# EAGLE schematic schematic (EAGLE 9.6.2)
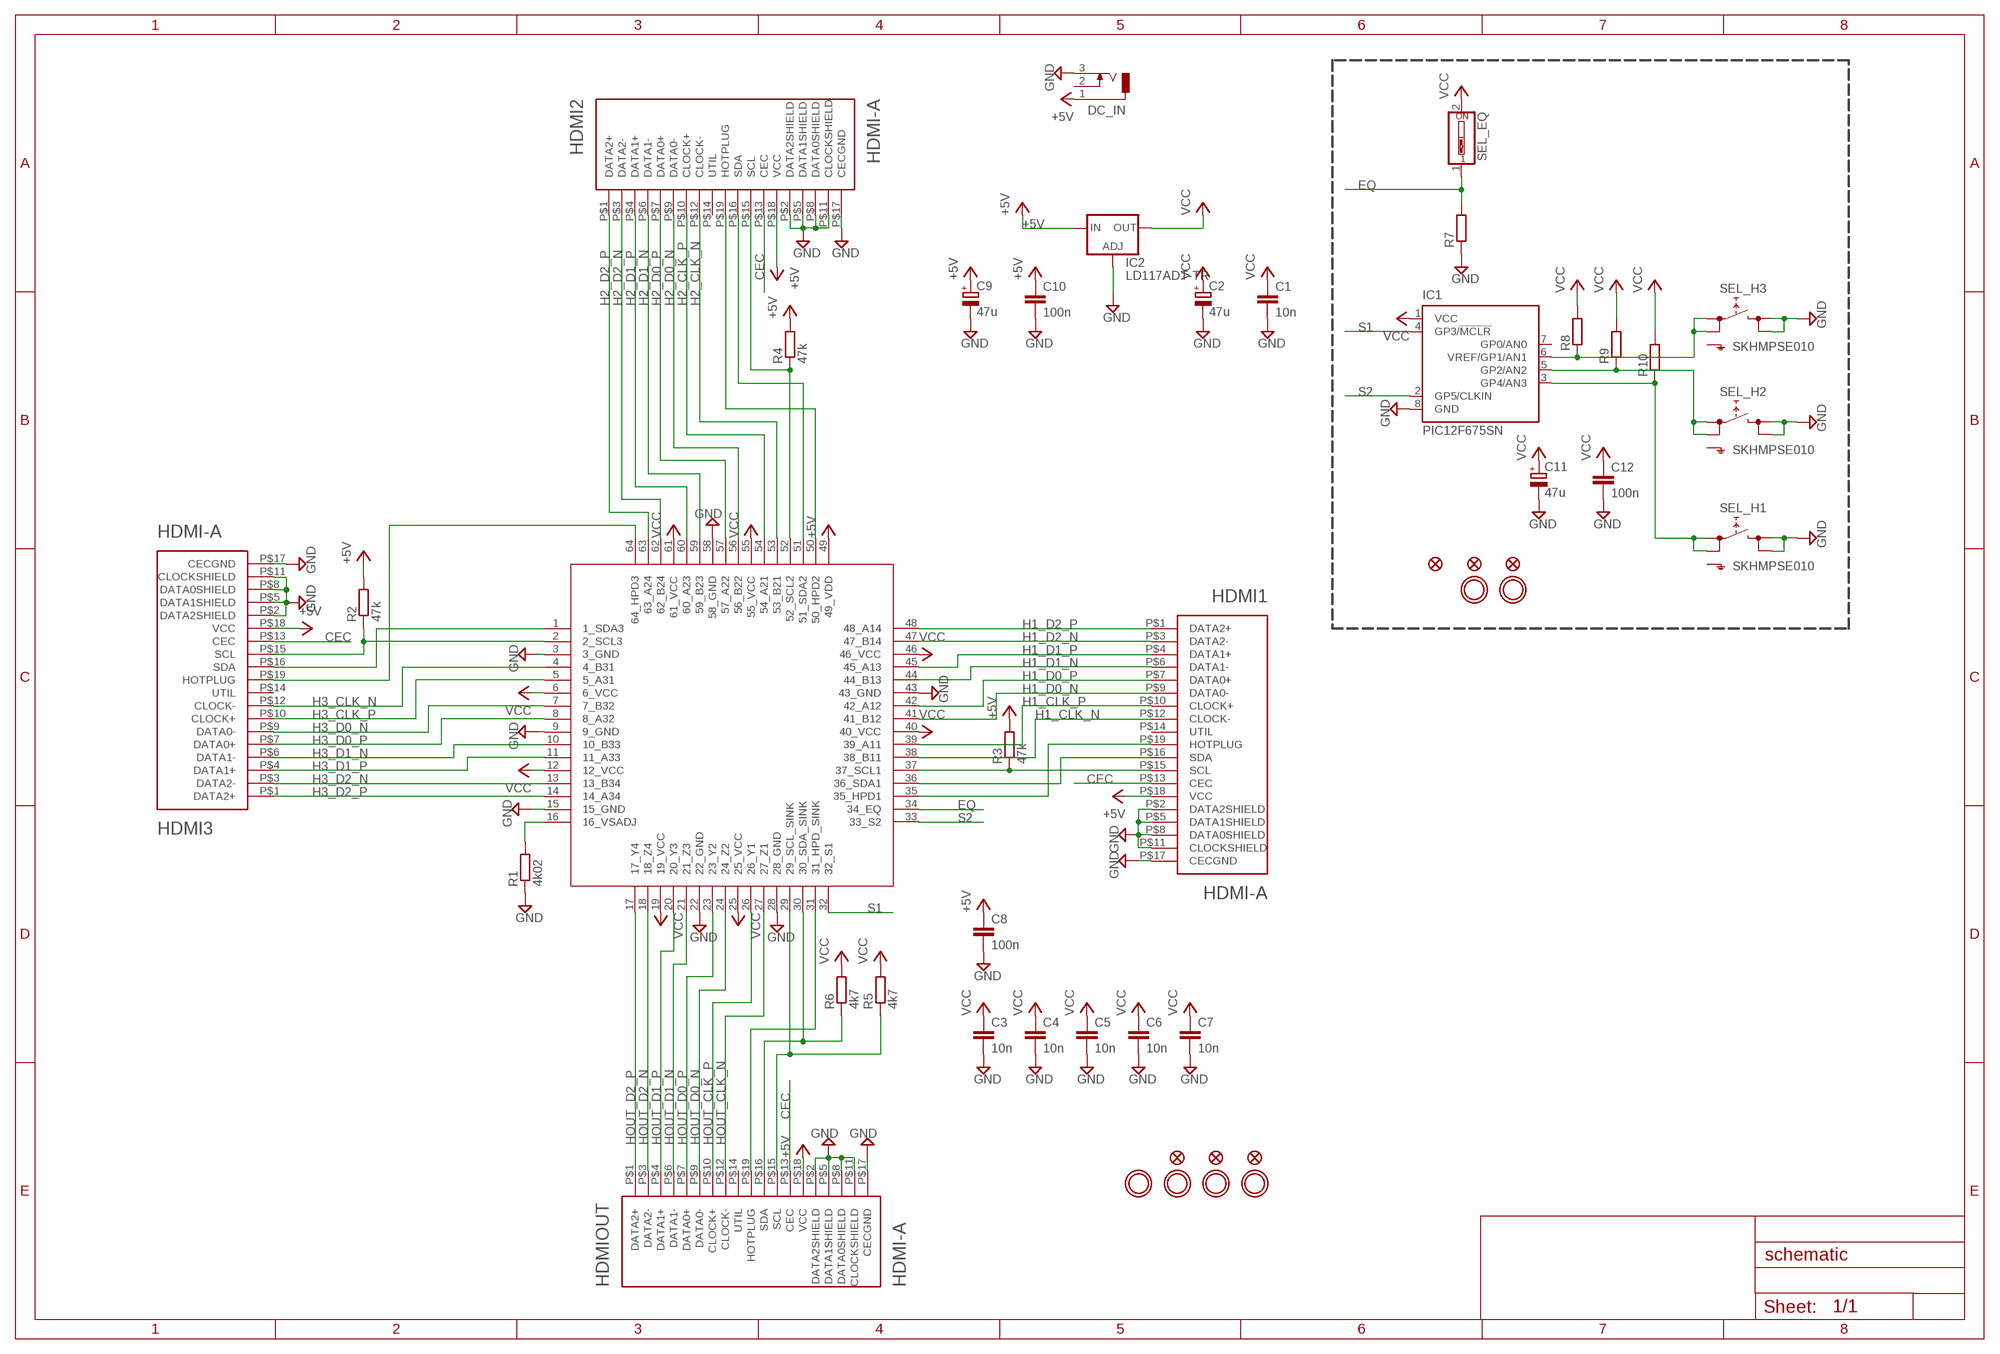
[diagram p0: schematic, sheet 1]

## Parts
C1  10n  C-EUC0402  [C0402]
C2  47u  CPOL-EUSMCA  [SMC_A]
C3  10n  C0402  [0402]
C4  10n  C0402  [0402]
C5  10n  C0402  [0402]
C6  10n  C0402  [0402]
C7  10n  C0402  [0402]
C8  100n  C0402  [0402]
C9  47u  CPOL-EUSMCA  [SMC_A]
C10  100n  C-EUC0402  [C0402]
C11  47u  CPOL-EUSMCA  [SMC_A]
C12  100n  C-EUC0402  [C0402]
DC_IN  DCJ0303  [DCJ0303]
FID1  FIDUCIAL""  [FIDUCIAL_1MM]
FID2  FIDUCIAL""  [FIDUCIAL_1MM]
FID3  FIDUCIAL""  [FIDUCIAL_1MM]
FID4  FIDUCIAL""  [FIDUCIAL_1MM]
FID5  FIDUCIAL""  [FIDUCIAL_1MM]
FID6  FIDUCIAL""  [FIDUCIAL_1MM]
HDMI1  HDMI-A  [HDMI_A]
HDMI2  HDMI-A  [HDMI_A]
HDMI3  HDMI-A  [HDMI_A]
HDMIOUT  HDMI-A  [HDMI_A]
IC1  PIC12F675SN  [SO-08]
IC2  LD117ADT-TR  [DPACK]
R1  4k02  R0402  [0402]
R2  47k  R0402  [0402]
R3  47k  R0402  [0402]
R4  47k  R0402  [0402]
R5  4k7  R0402  [0402]
R6  4k7  R0402  [0402]
R7  R-EU_R0805  [R0805]
R8  R-EU_R0805  [R0805]
R9  R-EU_R0805  [R0805]
R10  R-EU_R0805  [R0805]
SEL_EQ  SW_DIP-1  [EDG-01]
SEL_H1  SKHMPSE010  [SKHMPXE010]
SEL_H2  SKHMPSE010  [SKHMPXE010]
SEL_H3  SKHMPSE010  [SKHMPXE010]
U1  TMDS351TQFP64  [QFP50P1200X1200X120-64]
U$1  MOUNTINGHOLE3.0  [MOUNTINGHOLE_3.0_PLATED]
U$2  MOUNTINGHOLE3.0  [MOUNTINGHOLE_3.0_PLATED]
U$31  MOUNTINGHOLE3.0  [MOUNTINGHOLE_3.0_PLATED]
U$32  MOUNTINGHOLE3.0  [MOUNTINGHOLE_3.0_PLATED]
U$33  MOUNTINGHOLE3.0  [MOUNTINGHOLE_3.0_PLATED]
U$34  MOUNTINGHOLE3.0  [MOUNTINGHOLE_3.0_PLATED]

## Nets
+5V: C8.1 C9.+ C10.1 DC_IN.1 HDMI1.P$18(VCC) HDMI2.P$18(VCC) HDMI3.P$18(VCC) HDMIOUT.P$18(VCC) IC2.3(IN) R2.2 R3.2 R4.2 U1.49(49_VDD)
CEC: HDMI1.P$13(CEC) HDMI2.P$13(CEC) HDMI3.P$13(CEC) HDMIOUT.P$13(CEC)
EQ: R7.2 SEL_EQ.1 U1.34(34_EQ)
GND: C1.2 C2.- C3.2 C4.2 C5.2 C6.2 C7.2 C8.2 C9.- C10.2 C11.- C12.2 DC_IN.3 HDMI1.P$2(DATA2SHIELD) HDMI1.P$5(DATA1SHIELD) HDMI1.P$8(DATA0SHIELD) HDMI1.P$11(CLOCKSHIELD) HDMI1.P$17(CECGND) HDMI2.P$2(DATA2SHIELD) HDMI2.P$5(DATA1SHIELD) HDMI2.P$8(DATA0SHIELD) HDMI2.P$11(CLOCKSHIELD) HDMI2.P$17(CECGND) HDMI3.P$2(DATA2SHIELD) HDMI3.P$5(DATA1SHIELD) HDMI3.P$8(DATA0SHIELD) HDMI3.P$11(CLOCKSHIELD) HDMI3.P$17(CECGND) HDMIOUT.P$2(DATA2SHIELD) HDMIOUT.P$5(DATA1SHIELD) HDMIOUT.P$8(DATA0SHIELD) HDMIOUT.P$11(CLOCKSHIELD) HDMIOUT.P$17(CECGND) IC1.8(GND) IC2.1(ADJ) R1.1 R7.1 SEL_H1.3(2.1) SEL_H1.4(2.2) SEL_H2.3(2.1) SEL_H2.4(2.2) SEL_H3.3(2.1) SEL_H3.4(2.2) U1.3(3_GND) U1.9(9_GND) U1.15(15_GND) U1.22(22_GND) U1.28(28_GND) U1.43(43_GND) U1.58(58_GND)
H1_CLK_N [diff100]: HDMI1.P$12(CLOCK-) U1.38(38_B11)
H1_CLK_P [diff100]: HDMI1.P$10(CLOCK+) U1.39(39_A11)
H1_D0_N [diff100]: HDMI1.P$9(DATA0-) U1.41(41_B12)
H1_D0_P [diff100]: HDMI1.P$7(DATA0+) U1.42(42_A12)
H1_D1_N [diff100]: HDMI1.P$6(DATA1-) U1.44(44_B13)
H1_D1_P [diff100]: HDMI1.P$4(DATA1+) U1.45(45_A13)
H1_D2_N [diff100]: HDMI1.P$3(DATA2-) U1.47(47_B14)
H1_D2_P [diff100]: HDMI1.P$1(DATA2+) U1.48(48_A14)
H2_CLK_N [diff100]: HDMI2.P$12(CLOCK-) U1.53(53_B21)
H2_CLK_P [diff100]: HDMI2.P$10(CLOCK+) U1.54(54_A21)
H2_D0_N [diff100]: HDMI2.P$9(DATA0-) U1.56(56_B22)
H2_D0_P [diff100]: HDMI2.P$7(DATA0+) U1.57(57_A22)
H2_D1_N [diff100]: HDMI2.P$6(DATA1-) U1.59(59_B23)
H2_D1_P [diff100]: HDMI2.P$4(DATA1+) U1.60(60_A23)
H2_D2_N [diff100]: HDMI2.P$3(DATA2-) U1.62(62_B24)
H2_D2_P [diff100]: HDMI2.P$1(DATA2+) U1.63(63_A24)
H3_CLK_N [diff100]: HDMI3.P$12(CLOCK-) U1.4(4_B31)
H3_CLK_P [diff100]: HDMI3.P$10(CLOCK+) U1.5(5_A31)
H3_D0_N [diff100]: HDMI3.P$9(DATA0-) U1.7(7_B32)
H3_D0_P [diff100]: HDMI3.P$7(DATA0+) U1.8(8_A32)
H3_D1_N [diff100]: HDMI3.P$6(DATA1-) U1.10(10_B33)
H3_D1_P [diff100]: HDMI3.P$4(DATA1+) U1.11(11_A33)
H3_D2_N [diff100]: HDMI3.P$3(DATA2-) U1.13(13_B34)
H3_D2_P [diff100]: HDMI3.P$1(DATA2+) U1.14(14_A34)
HOUT_CLK_N [diff100]: HDMIOUT.P$12(CLOCK-) U1.27(27_Z1)
HOUT_CLK_P [diff100]: HDMIOUT.P$10(CLOCK+) U1.26(26_Y1)
HOUT_D0_N [diff100]: HDMIOUT.P$9(DATA0-) U1.24(24_Z2)
HOUT_D0_P [diff100]: HDMIOUT.P$7(DATA0+) U1.23(23_Y2)
HOUT_D1_N [diff100]: HDMIOUT.P$6(DATA1-) U1.21(21_Z3)
HOUT_D1_P [diff100]: HDMIOUT.P$4(DATA1+) U1.20(20_Y3)
HOUT_D2_N [diff100]: HDMIOUT.P$3(DATA2-) U1.18(18_Z4)
HOUT_D2_P [diff100]: HDMIOUT.P$1(DATA2+) U1.17(17_Y4)
N$25: HDMI3.P$19(HOTPLUG) U1.64(64_HPD3)
N$26: HDMI2.P$19(HOTPLUG) U1.50(50_HPD2)
N$27: HDMI1.P$19(HOTPLUG) U1.35(35_HPD1)
N$36: HDMIOUT.P$19(HOTPLUG) U1.31(31_HPD_SINK)
N$37: HDMI3.P$16(SDA) U1.1(1_SDA3)
N$38: HDMI3.P$15(SCL) R2.1 U1.2(2_SCL3)
N$39: HDMI2.P$16(SDA) U1.51(51_SDA2)
N$40: HDMI2.P$15(SCL) R4.1 U1.52(52_SCL2)
N$41: HDMI1.P$15(SCL) R3.1 U1.37(37_SCL1)
N$42: HDMI1.P$16(SDA) U1.36(36_SDA1)
N$43: HDMIOUT.P$16(SDA) R6.1 U1.30(30_SDA_SINK)
N$44: HDMIOUT.P$15(SCL) R5.1 U1.29(29_SCL_SINK)
N$45: R1.2 U1.16(16_VSADJ)
N$50: IC1.6(VREF/GP1/AN1) R8.1 SEL_H3.1(1.1) SEL_H3.2(1.2)
N$51: IC1.5(GP2/AN2) R9.1 SEL_H2.1(1.1) SEL_H2.2(1.2)
N$52: IC1.3(GP4/AN3) R10.1 SEL_H1.1(1.1) SEL_H1.2(1.2)
S1: IC1.4(GP3/!MCLR) U1.32(32_S1)
S2: IC1.2(GP5/CLKIN) U1.33(33_S2)
VCC: C1.1 C2.+ C3.1 C4.1 C5.1 C6.1 C7.1 C11.+ C12.1 IC1.1(VCC) IC2.4(OUT) R5.2 R6.2 R8.2 R9.2 R10.2 SEL_EQ.2 U1.6(6_VCC) U1.12(12_VCC) U1.19(19_VCC) U1.25(25_VCC) U1.40(40_VCC) U1.46(46_VCC) U1.55(55_VCC) U1.61(61_VCC)
Unconnected: DC_IN.2 HDMI1.P$14(UTIL) HDMI2.P$14(UTIL) HDMI3.P$14(UTIL) HDMIOUT.P$14(UTIL) IC1.7(GP0/AN0) SEL_H1.5(SH) SEL_H2.5(SH) SEL_H3.5(SH)

## Library data of the parts
C1 C10 C12 = rcl:C-EU: CAPACITOR, European symbol; SPICEPREFIX: C
C2 C9 C11 = rcl:CPOL-EU: POLARIZED CAPACITOR, European symbol; SPICEPREFIX: C
C3-C8 = labHDE_rev3:C0402
DC_IN = con-jack:DCJ0303: DC POWER JACK Source: DCJ0303.pdf; OC_FARNELL: unknown; OC_NEWARK: unknown
FID1-FID6 = microbuilder:FIDUCIAL: Fiducial Alignment Points Various fiducial points for machine vision alignment.; BOM: EXCLUDE
HDMI1-HDMI3 HDMIOUT = labHDE_rev3:HDMI-A: Horizonal HDMI type "A" jack
IC1 = microchip:PIC12F675: 8-Pin FLASH-Based 8-Bit CMOS Microcontroller Precision Internal 4 MHz oscillator factory calibrated to ±1% Low Power Features: Standby Current: - 1 nA @ 2.0V, typical Operating Current: - 8.5µA @ 32 kHz, 2.0V, typical - 100µA @ 1 MHz, 2.0V, typical Watchdog Timer Current: - 300 nA @ 2.0V, typical Timer1 oscillator current: - 4µA @ 32 kHz, 2.0V, typical Analog-to-Digital Converter module: - 10-bit resolution - Programmable 4-channel input - Voltage reference input Source: http://www.microchip.com .. 41190E.pdf; MF: MICROCHIP; MPN: PIC12F675-E/SN; OC_FARNELL: 9759026; OC_NEWARK: 92C4341
IC2 = v-reg:LD117A?*: Low drop fixed and adjustable positive voltage regulators 1 A Source: http://www.st.com/stonline/products/literature/ds/7194/ld1117axx.pdf
R1-R6 = labHDE_rev3:R0402
R7-R10 = rcl:R-EU_: RESISTOR, European symbol; SPICEPREFIX: R
SEL_EQ = special:SW_DIP-1: DIP SWITCH
SEL_H1-SEL_H3 = switch:SKHMP*E010: 6.2 X 6.5mm TACT Switch (SMD) Source: http://www3.alps.co.jp/WebObjects/catalog.woa/PDF/E/Switch/Tact/SKHM/SKHM.PDF
U1 = labHDE_rev3:TMDS351
U$1 U$2 U$31-U$34 = microbuilder:MOUNTINGHOLE: Mounting Hole For #2 screws (0.086"/2.18mm width, 0.094"/2.4mm hole) use 2.5mm; BOM: EXCLUDE

## Net classes
1 diff100: width 0.26 mm, clearance 0.15 mm